# EAGLE design AeroQuadMini_v201 (EAGLE 5.11)
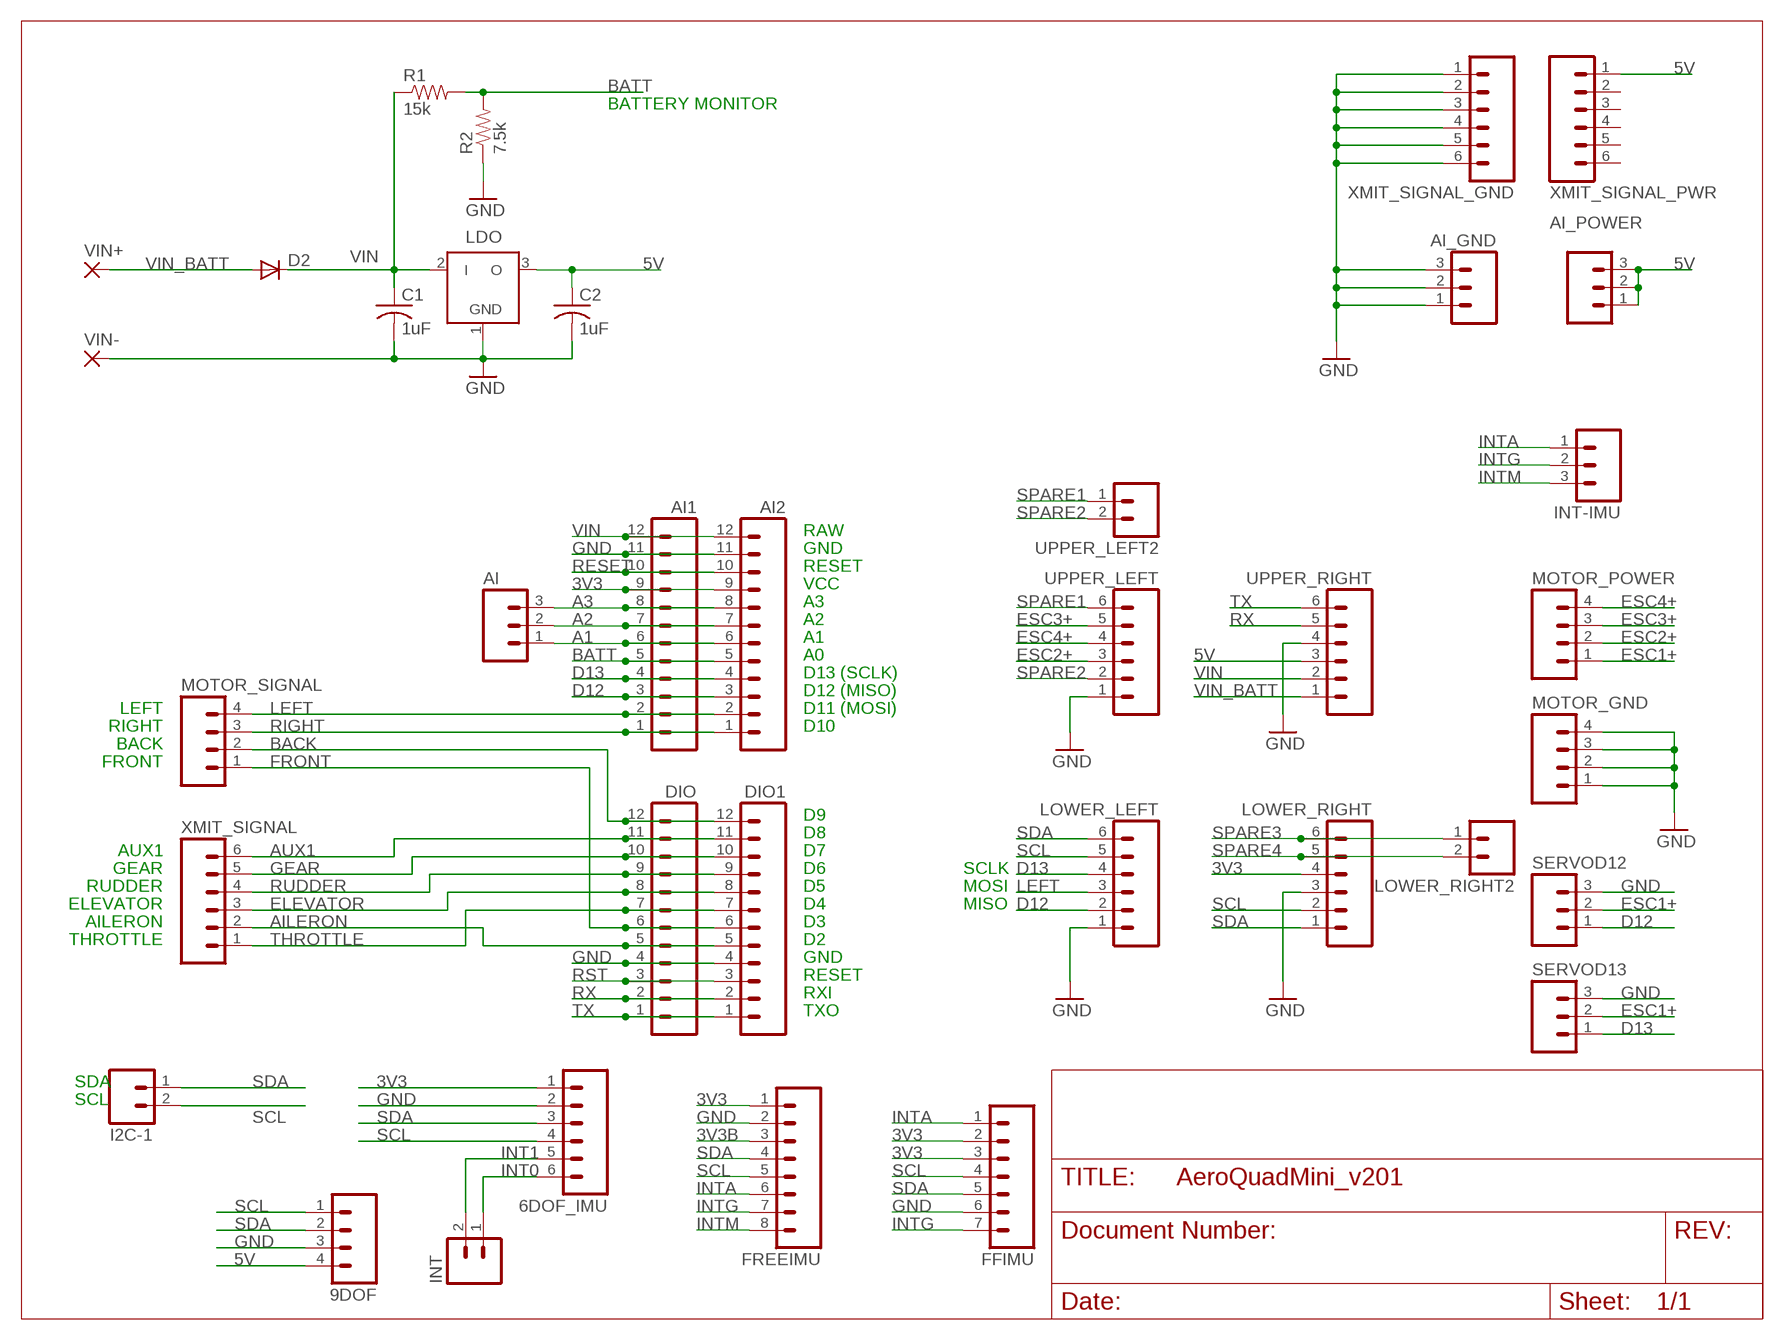
[diagram p0: schematic, sheet 1]

## Parts
6DOF_IMU  M06LOCK  [1X06_LOCK]
9DOF  M04LOCK  [1X04_LOCK]
AI  M03LOCK  [1X03_LOCK]
AI1  M12LOCK  [1X12_LOCK]
AI2  M12LOCK  [1X12_LOCK]
AI_GND  M03LOCK  [1X03_LOCK]
AI_POWER  M03LOCK  [1X03_LOCK]
C1  1uF  C-US050-024X044  [C050-024X044]
C2  1uF  C-US050-024X044  [C050-024X044]
D2  DIODEPTH  [DIODE-1N4001]
DIO  M12LOCK  [1X12_LOCK]
DIO1  M12LOCK  [1X12_LOCK]
FFIMU  M07LOCK  [1X07_LOCK]
FREEIMU  M08LOCK  [1X08_LOCK]
I2C-1  M02LOCK  [1X02_LOCK]
INT  M02PTH  [1X02]
INT-IMU  M03LOCK  [1X03_LOCK]
LDO  MCP1702-33  MCP1702Z  [TO92]
LOWER_LEFT  M06LOCK  [1X06_LOCK]
LOWER_RIGHT  M06LOCK  [1X06_LOCK]
LOWER_RIGHT2  M02LOCK  [1X02_LOCK]
MOTOR_GND  M04LOCK  [1X04_LOCK]
MOTOR_POWER  M04LOCK  [1X04_LOCK]
MOTOR_SIGNAL  M04LOCK  [1X04_LOCK]
R1  15k  RESISTORPTH-1/6W  [1/6W-RES]
R2  7.5k  RESISTORPTH-1/6W  [1/6W-RES]
SERVOD12  M03LOCK  [1X03_LOCK]
SERVOD13  M03LOCK  [1X03_LOCK]
UPPER_LEFT  M06LOCK  [1X06_LOCK]
UPPER_LEFT2  M02LOCK  [1X02_LOCK]
UPPER_RIGHT  M06LOCK  [1X06_LOCK]
VIN+  3,81/1,4  [3,81/1,4]
VIN-  3,81/1,4  [3,81/1,4]
XMIT_SIGNAL  M06LOCK  [1X06_LOCK]
XMIT_SIGNAL_GND  M06LOCK  [1X06_LOCK]
XMIT_SIGNAL_PWR  M06LOCK  [1X06_LOCK]

## Nets
3V3: 6DOF_IMU.1 AI1.9 AI2.9 FFIMU.2 FFIMU.3 FREEIMU.1 LOWER_RIGHT.4
3V3B: FREEIMU.3
5V: 9DOF.4 AI_POWER.1 AI_POWER.2 AI_POWER.3 C2.1 LDO.3(O) UPPER_RIGHT.3 XMIT_SIGNAL_PWR.1
A1: AI1.6 AI2.6 AI.1
A2: AI1.7 AI2.7 AI.2
A3: AI1.8 AI2.8 AI.3
AILERON: DIO1.5 DIO.5 XMIT_SIGNAL.2
AUX1: DIO1.11 DIO.11 XMIT_SIGNAL.6
BACK: DIO1.12 DIO.12 MOTOR_SIGNAL.2
BATT: AI1.5 AI2.5 R1.2 R2.2
D12: AI1.3 AI2.3 LOWER_LEFT.2 SERVOD12.1
D13: AI1.4 AI2.4 LOWER_LEFT.4 SERVOD13.1
ELEVATOR: DIO1.8 DIO.8 XMIT_SIGNAL.3
ESC1+: MOTOR_POWER.1 SERVOD12.2 SERVOD13.2
ESC2+: MOTOR_POWER.2 UPPER_LEFT.3
ESC3+: MOTOR_POWER.3 UPPER_LEFT.5
ESC4+: MOTOR_POWER.4 UPPER_LEFT.4
FRONT: DIO1.6 DIO.6 MOTOR_SIGNAL.1
GEAR: DIO1.10 DIO.10 XMIT_SIGNAL.5
GND: 6DOF_IMU.2 9DOF.3 AI1.11 AI2.11 AI_GND.1 AI_GND.2 AI_GND.3 C1.2 C2.2 DIO1.4 DIO.4 FFIMU.6 FREEIMU.2 LDO.1(GND) LOWER_LEFT.1 LOWER_RIGHT.3 MOTOR_GND.1 MOTOR_GND.2 MOTOR_GND.3 MOTOR_GND.4 R2.1 SERVOD12.3 SERVOD13.3 UPPER_LEFT.1 UPPER_RIGHT.4 VIN-.1(P) XMIT_SIGNAL_GND.1 XMIT_SIGNAL_GND.2 XMIT_SIGNAL_GND.3 XMIT_SIGNAL_GND.4 XMIT_SIGNAL_GND.5 XMIT_SIGNAL_GND.6
INT0: 6DOF_IMU.6 INT.1
INT1: 6DOF_IMU.5 INT.2
INTA: FFIMU.1 FREEIMU.6 INT-IMU.1
INTG: FFIMU.7 FREEIMU.7 INT-IMU.2
INTM: FREEIMU.8 INT-IMU.3
LEFT: AI1.2 AI2.2 LOWER_LEFT.3 MOTOR_SIGNAL.4
RESET: AI1.10 AI2.10
RIGHT: AI1.1 AI2.1 MOTOR_SIGNAL.3
RST: DIO1.3 DIO.3
RUDDER: DIO1.9 DIO.9 XMIT_SIGNAL.4
RX: DIO1.2 DIO.2 UPPER_RIGHT.5
SCL: 6DOF_IMU.4 9DOF.1 FFIMU.4 FREEIMU.5 I2C-1.2 LOWER_LEFT.5 LOWER_RIGHT.2
SDA: 6DOF_IMU.3 9DOF.2 FFIMU.5 FREEIMU.4 I2C-1.1 LOWER_LEFT.6 LOWER_RIGHT.1
SPARE1: UPPER_LEFT2.1 UPPER_LEFT.6
SPARE2: UPPER_LEFT2.2 UPPER_LEFT.2
SPARE3: LOWER_RIGHT2.1 LOWER_RIGHT.6
SPARE4: LOWER_RIGHT2.2 LOWER_RIGHT.5
THROTTLE: DIO1.7 DIO.7 XMIT_SIGNAL.1
TX: DIO1.1 DIO.1 UPPER_RIGHT.6
VIN: AI1.12 AI2.12 C1.1 D2.C LDO.2(I) R1.1 UPPER_RIGHT.2
VIN_BATT: D2.A UPPER_RIGHT.1 VIN+.1(P)
Unconnected: XMIT_SIGNAL_PWR.2 XMIT_SIGNAL_PWR.3 XMIT_SIGNAL_PWR.4 XMIT_SIGNAL_PWR.5 XMIT_SIGNAL_PWR.6

## Notes on the sheet
- BATTERY MONITOR
- RAW
- GND
- RESET
- VCC
- A3
- A2
- A1
- A0
- D13 (SCLK)
- D12 (MISO)
- LEFT | D11 (MOSI)
- RIGHT | D10
- BACK
- FRONT
- D9
- D8
- AUX1 | D7
- GEAR | D6 | SCLK
- RUDDER | D5 | MOSI
- ELEVATOR | D4 | MISO
- AILERON | D3
- THROTTLE | D2
- GND
- RESET
- RXI
- TXO
- SDA
- SCL

## Library data of the parts
6DOF_IMU LOWER_LEFT LOWER_RIGHT UPPER_LEFT UPPER_RIGHT XMIT_SIGNAL XMIT_SIGNAL_GND XMIT_SIGNAL_PWR = SparkFun:M06: Header 6 Standard 6-pin 0.1" header. Use with straight break away headers (SKU : PRT-00116), right angle break away headers (PRT-00553), swiss pins (PRT-00743), machine pins (PRT-00117), and female headers (PRT-00115). Molex polarized connector foot print use with SKU : PRT-08094 with associated crimp pins and housings. NOTES ON THE VARIANTS LOCK and LOCK_LONGPADS... This footprint was designed to help hold the alignment of a through-hole component (i.e. 6-pin header) while soldering it into place. You may notice that each hole has been shifted either up or down by 0.005 of an inch from it's more standard position (which is a perfectly straight line). This slight alteration caused the pins (the squares in the middle) to touch the edges of the holes. Because they are alternating, it causes a "brace" to hold the component in place. 0.005 has proven to be the perfect amount of "off-center" position when using our standard breakaway headers. Although looks a little odd when you look at the bare footprint, once you have a header in there, the alteration is very hard to notice. Also, if you push a header all the way into place, it is covered up entirely on the bottom side. This idea of altering the position of holes to aid alignment will be further integrated into the Sparkfun Library for other footprints. It can help hold any component with 3 or more connection pins.
9DOF MOTOR_GND MOTOR_POWER MOTOR_SIGNAL = SparkFun:M04: Header 4 Standard 4-pin 0.1" header. Use with straight break away headers (SKU : PRT-00116), right angle break away headers (PRT-00553), swiss pins (PRT-00743), machine pins (PRT-00117), and female headers (PRT-00115). Molex polarized connector foot print use with SKU : PRT-08231 with associated crimp pins and housings. 1MM SMD Version SKU: PRT-10208
AI AI_GND AI_POWER INT-IMU SERVOD12 SERVOD13 = SparkFun:M03: Header 3 Standard 3-pin 0.1" header. Use with straight break away headers (SKU : PRT-00116), right angle break away headers (PRT-00553), swiss pins (PRT-00743), machine pins (PRT-00117), and female headers (PRT-00115). Molex polarized connector foot print use with SKU : PRT-08232 with associated crimp pins and housings.
AI1 AI2 DIO DIO1 = SparkFun:M12: Header 12 Standard 12-pin 0.1" header. Use with straight break away headers (SKU : PRT-00116), right angle break away headers (PRT-00553), swiss pins (PRT-00743), machine pins (PRT-00117), and female headers (PRT-00115).
C1 C2 = resistor:C-US: CAPACITOR, American symbol
D2 = SparkFun:DIODE: Diode These are standard reverse protection diodes and small signal diodes. SMA package can handle up to about 1A. SOD-323 can handle about 200mA. What the SOD-323 package when ordering, there are some mfgs out there that are 5-pin packages.
FFIMU = SparkFun:M07: Header 7 Standard 7-pin 0.1" header. Use with straight break away headers (SKU : PRT-00116), right angle break away headers (PRT-00553), swiss pins (PRT-00743), machine pins (PRT-00117), and female headers (PRT-00115). NOTES ON THE VARIANTS LOCK and LOCK_LONGPADS... This footprint was designed to help hold the alignment of a through-hole component (i.e. 7-pin header) while soldering it into place. You may notice that each hole has been shifted either up or down by 0.005 of an inch from it's more standard position (which is usually a perfectly straight line). This slight alteration caused the pins (the squares in the middle) to touch the edges of the holes. Because they are alternating, it causes a "brace" to hold the header in place. 0.005 has proven to be the perfect amount of "off-center" position when using our standard breakaway headers. Although looks a little odd when you look at the bare footprint, once you have a header in there, the alteration is very hard to notice. Also, if you push a header all the way into place, it is covered up entirely on the bottom side. This idea of altering the position of holes to aid alignment will be further integrated into the Sparkfun Library for other footprints. It can help hold any component with 3 or more connection pins.
FREEIMU = SparkFun:M08: Header 8 Standard 8-pin 0.1" header. Use with straight break away headers (SKU : PRT-00116), right angle break away headers (PRT-00553), swiss pins (PRT-00743), machine pins (PRT-00117), and female headers (PRT-00115).
I2C-1 INT LOWER_RIGHT2 UPPER_LEFT2 = SparkFun:M02: Header 2 Standard 2-pin 0.1" header. Use with straight break away headers (SKU : PRT-00116), right angle break away headers (PRT-00553), swiss pins (PRT-00743), machine pins (PRT-00117), and female headers (PRT-00115). Molex polarized connector foot print use with SKU : PRT-08233 with associated crimp pins and housings.
LDO = JeeLabs:MCP1702: 200 mA, Low Power Low Dropout Voltage Regulator
R1 R2 = SparkFun:RESISTOR: Resistor Basic schematic elements and footprints for 0603, 1206, and PTH 1/10th watt (small) resistors.
VIN+ VIN- = wirepad:3,81/1,4: THROUGH-HOLE PAD

## Net classes
1 power: width 0.381 mm, clearance 0.254 mm

## Board
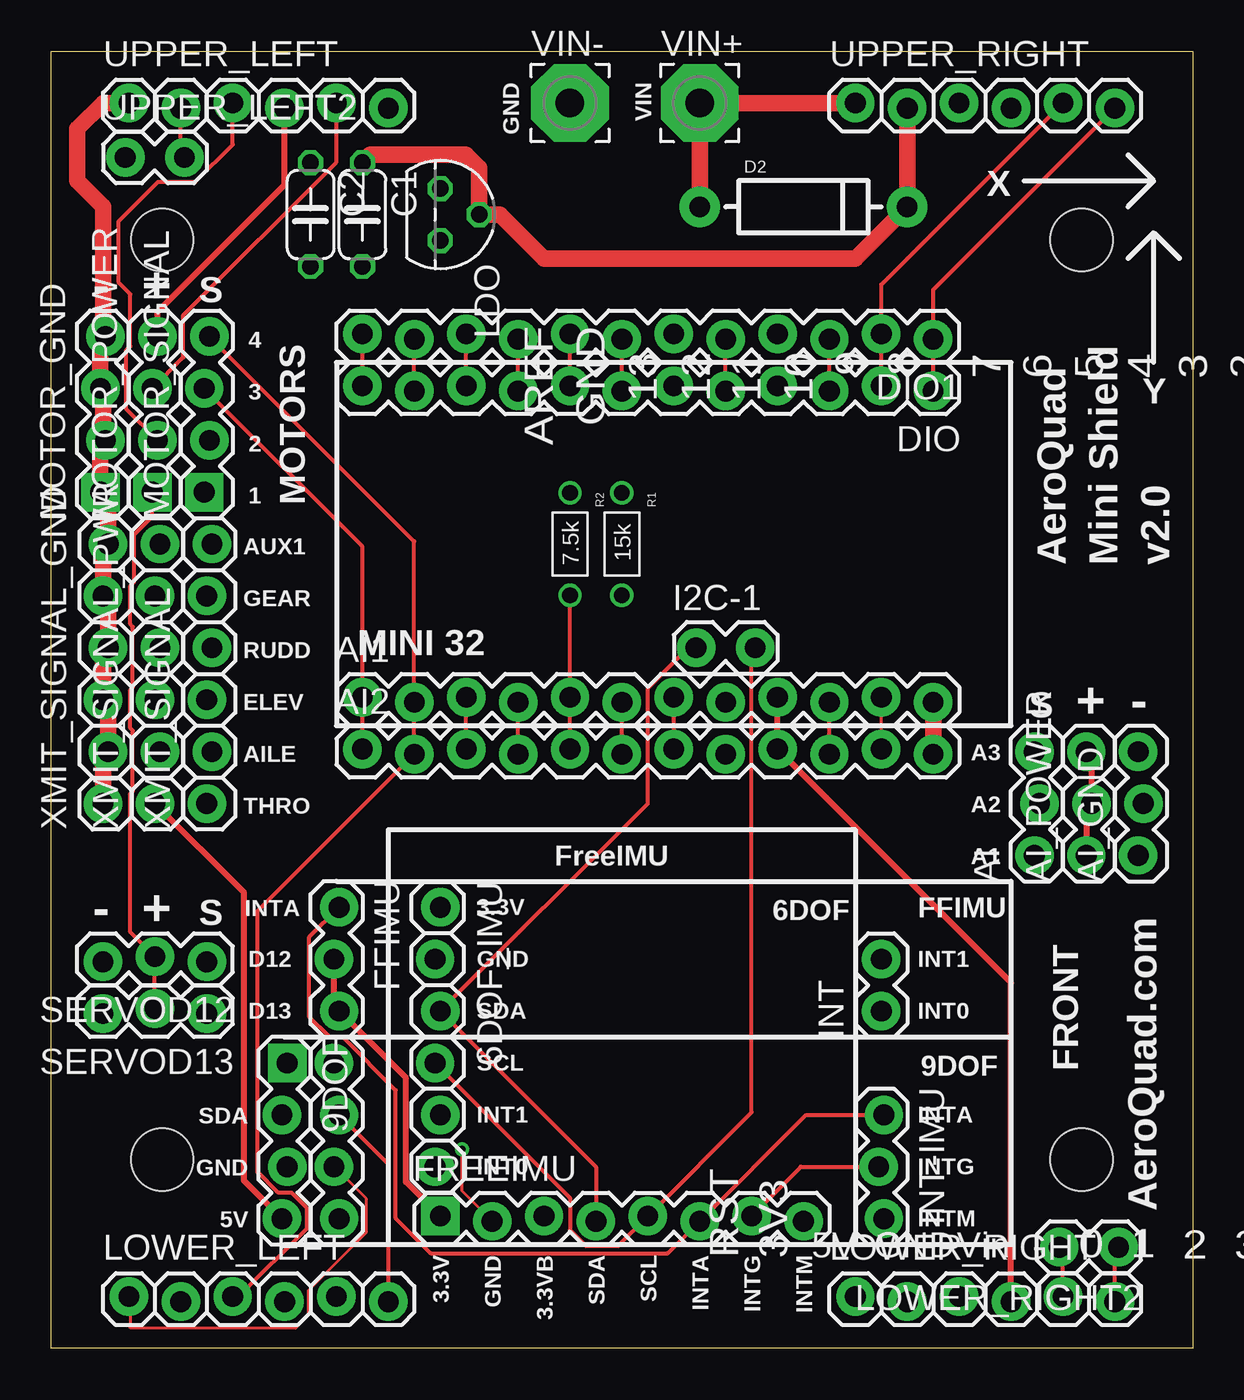
[diagram p1: board, top side]
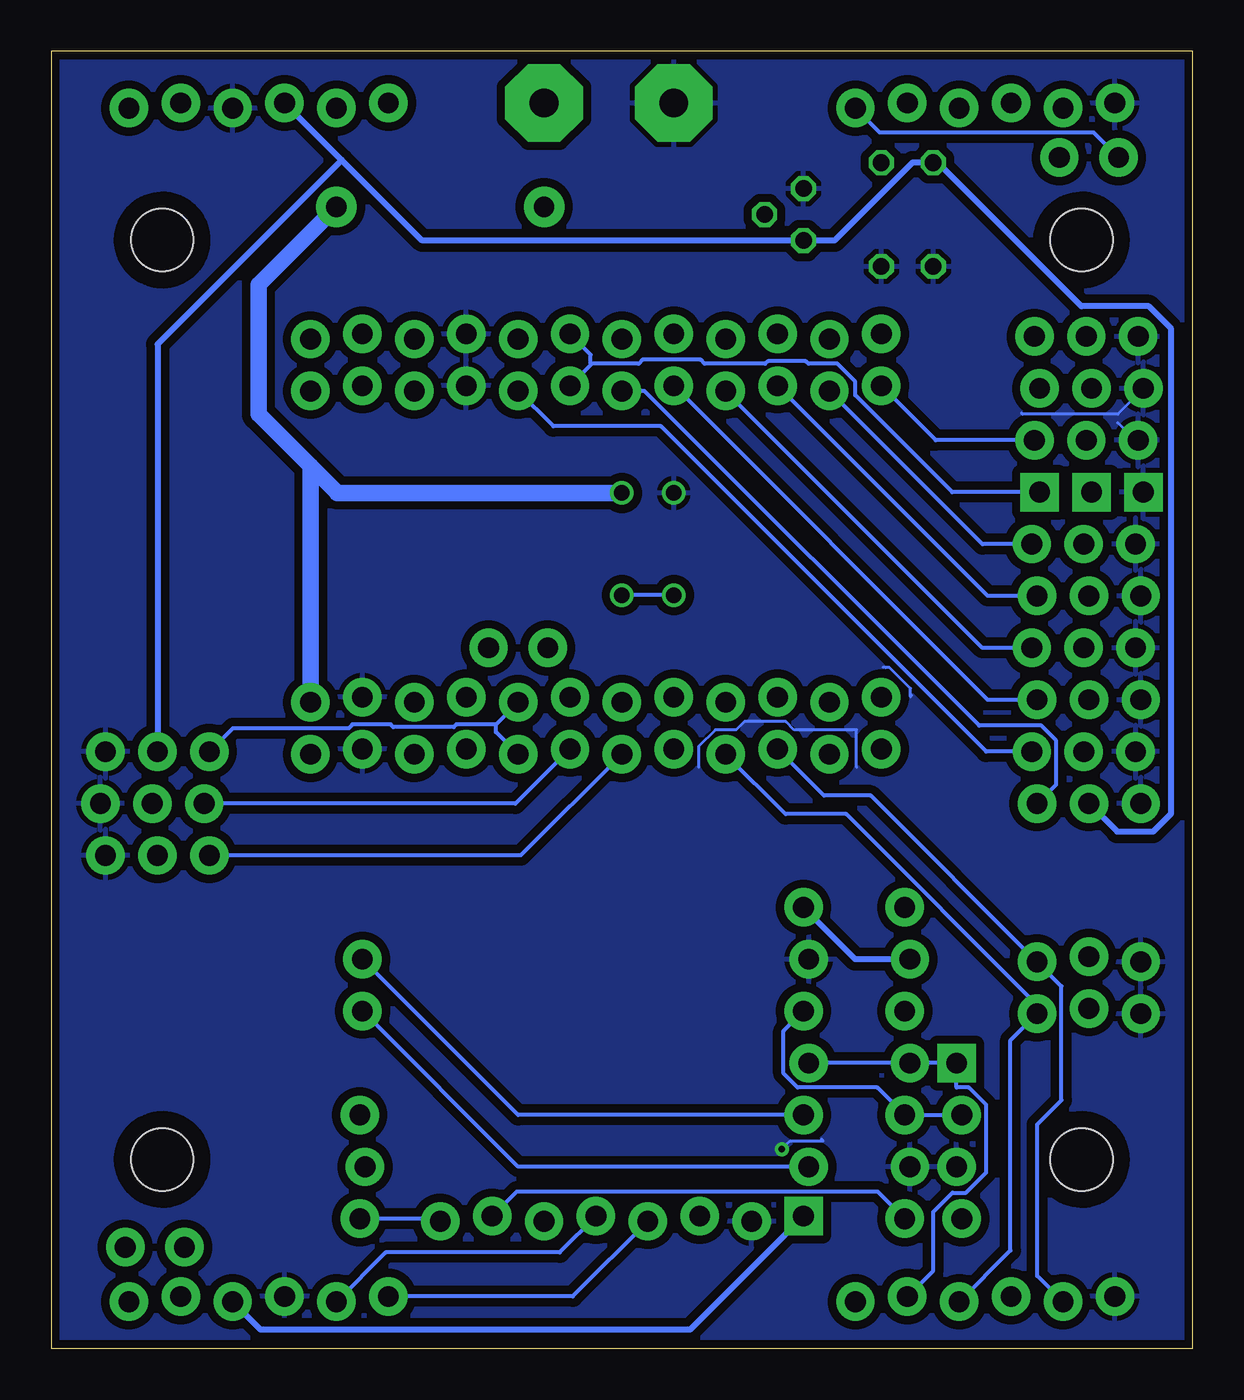
[diagram p2: board, bottom side, seen from below]

Size 55.88 x 63.5 mm. Coordinates in mm from the lower left corner, seen from the top.
Outline: 0,63.5 55.88,63.5 55.88,0 0,0 0,63.5
Copper layers (1*16): Top 0.0356mm / dielectric 1.5011mm / Bottom 0.0356mm
Design rules "LaenPCBOrder": minimum track width 6mil, minimum drill 13mil, track to track 6mil, track to pad 6mil, pad to pad 6mil, via to via 6mil, smd to smd 6mil, copper to edge 15mil, drill to drill 6mil, minimum pad ring 7mil, minimum via ring 7mil, stop-mask expansion 4mil, vias tented up to drill 0mil, thermal gap 10mil

### Footprints (pad centres in the part's own frame; a part is rotated, then mirrored left to right if it is on the bottom)
1X06_LOCK = drill 1.016 pad 1.88 round: 1 0,0; 2 2.54,-0.254; 3 5.08,0; 4 7.62,-0.254; 5 10.16,0; 6 12.7,-0.254
1X04_LOCK = drill 1.016 pad 1.88 square: 1 0,0.127 | drill 1.016 pad 1.88 round: 2 2.54,-0.127; 3 5.08,0.127; 4 7.62,-0.127
1X03_LOCK = drill 1.016 pad 1.88 round: 1 0,0.127; 2 2.54,-0.127; 3 5.08,0.127
1X12_LOCK = drill 1.016 pad 1.88 round: 1 0,0.127; 2 2.54,-0.127; 3 5.08,0.127; 4 7.62,-0.127; 5 10.16,0.127; 6 12.7,-0.127; 7 15.24,0.127; 8 17.78,-0.127; 9 20.32,0.127; 10 22.86,-0.127; 11 25.4,0.127; 12 27.94,-0.127
C050-024X044 = drill 0.813 octagon: 1 -2.54,0; 2 2.54,0
DIODE-1N4001 = drill 1 pad 1.981 round: A -5.08,0; C 5.08,0
1X07_LOCK = drill 1.016 pad 1.88 round: 1 0,0.127; 2 2.54,-0.127; 3 5.08,0.127; 4 7.62,-0.127; 5 10.16,0.127; 6 12.7,-0.127; 7 15.24,0.127
1X08_LOCK = drill 1.016 pad 1.88 square: 1 0,0.127 | drill 1.016 pad 1.88 round: 2 2.54,-0.127; 3 5.08,0.127; 4 7.62,-0.127; 5 10.16,0.127; 6 12.7,-0.127; 7 15.24,0.127; 8 17.78,-0.127
1X02_LOCK = drill 1.016 pad 1.88 round: 1 -0.178,0; 2 2.718,0
1X02 = drill 1.016 pad 1.88 round: 1 0,0; 2 2.54,0
TO92 = drill 0.813 octagon: 1 -1.27,0; 2 0,1.905; 3 1.27,0
1/6W-RES = drill 0.762 round: 1 -2.5,0; 2 2.5,0
STAND-OFF-TIGHT = hole 3.048: 0,0
3,81/1,4 = drill 1.397 pad 3.81 octagon: 1 0,0

### Placement (x,y rotation side)
6DOF_IMU  19.05,21.59 270 top
9DOF  11.43,13.97 270 top
AI  48.26,24.13 90 top
AI1  15.24,31.75 0 top
AI2  15.24,29.21 0 top
AI_GND  53.34,24.13 90 top
AI_POWER  50.8,24.13 90 top
C1  15.24,55.5 270 top
C2  12.7,55.5 270 top
D2  36.83,55.88 0 top
DIO  43.18,46.99 180 top
DIO1  43.18,49.53 180 top
FFIMU  13.97,21.59 270 top
FREEIMU  19.05,6.35 0 top
I2C-1  31.75,34.29 0 top
INT  40.64,16.51 90 top
INT-IMU  40.64,11.43 270 top
LDO  19.05,55.5 270 top
LOWER_LEFT  3.81,2.54 0 top
LOWER_RIGHT  39.37,2.54 0 top
LOWER_RIGHT2  52.07,4.95 180 top
MOTOR_GND  2.54,41.91 90 top
MOTOR_POWER  5.08,41.91 90 top
MOTOR_SIGNAL  7.62,41.91 90 top
R1  27.94,39.37 270 top
R2  25.4,39.37 270 top
SERVOD12  7.62,19.05 180 top
SERVOD13  7.62,16.51 180 top
U$1  [STAND-OFF-TIGHT]  5.44,9.25 0 top
U$2  [STAND-OFF-TIGHT]  50.44,9.25 0 top
U$3  [STAND-OFF-TIGHT]  50.44,54.25 0 top
U$5  [STAND-OFF-TIGHT]  5.44,54.25 0 top
UPPER_LEFT  3.81,60.96 0 top
UPPER_LEFT2  3.81,58.29 0 top
UPPER_RIGHT  39.37,60.96 0 top
VIN+  31.75,60.96 0 top
VIN-  25.4,60.96 0 top
XMIT_SIGNAL  7.62,26.67 90 top
XMIT_SIGNAL_GND  2.54,26.67 90 top
XMIT_SIGNAL_PWR  5.08,26.67 90 top

### Tracks (layer width: path | path; a pad name or v marks a point on that pad's centre or on a via)
3V3
  Top 0.305: FREEIMU.1 17.37,8.15 17.37,13.23 FFIMU.3 13.84,16.76 FFIMU.2 | LOWER_RIGHT.4 46.99,17.91 AI2.9 AI1.9
  Bottom 0.305: FFIMU.2 16.51,19.05 6DOF_IMU.1 | LOWER_RIGHT.4 45.63,0.92 24.61,0.92 FREEIMU.1
5V
  Top 0.305: XMIT_SIGNAL_PWR.1 9.44,22.31 9.44,8.21 9DOF.4 | AI_POWER.1 50.67,26.42 AI_POWER.2 50.93,28.96 AI_POWER.3
  Bottom 0.305: 41.66,58.16 UPPER_RIGHT.3 | 41.66,58.16 37.72,54.23 LDO.3 17.53,54.23 13.72,58.04 C2.1 12.48,58.04 11.68,57.25 5.44,51 2.15,51 1.05,49.91 1.05,26.18 1.93,25.29 3.7,25.29 XMIT_SIGNAL_PWR.1 | 41.66,58.16 50.67,49.15 AI_POWER.3
A1
  Top 0.203: AI2.6 AI1.6
  Bottom 0.203: AI2.6 32.89,24.13 AI.1
A2
  Top 0.203: AI2.7 AI1.7
  Bottom 0.203: AI2.7 33.15,26.67 AI.2
A3
  Bottom 0.203: 34.1,30.54 36.04,30.54 36.17,30.42 39.13,30.42 39.26,30.54 41.12,30.54 41.31,30.35 46.99,30.35 AI.3 | 34.1,30.54 AI1.8 | AI2.8 34.1,30.16 34.1,30.54
AILERON
  Top 0.203: DIO.5 DIO1.5
  Bottom 0.203: XMIT_SIGNAL.2 10.11,29.21 26.04,45.14 31.3,45.14 DIO.5
AUX1
  Top 0.203: DIO.11 DIO1.11
  Bottom 0.203: XMIT_SIGNAL.6 10.29,39.37 DIO.11
BACK
  Top 0.203: DIO.12 DIO1.12
  Bottom 0.203: MOTOR_SIGNAL.2 12.57,44.45 DIO.12
BATT
  Top 0.203: AI2.5 AI1.5 R2.2
  Bottom 0.203: R2.2 R1.2
D12
  Top 0.203: AI2.3 AI1.3
  Bottom 0.203: LOWER_LEFT.2 7.62,3.55 7.62,10.96 6.42,12.15 6.42,17.73 SERVOD12.1 15.76,27.06 18.04,27.06 AI2.3
D13
  Top 0.203: AI2.4 AI1.4
  Bottom 0.203: LOWER_LEFT.4 8.91,4.8 8.91,15.09 SERVOD13.1 7.62,16.81 16.96,26.16 19.93,26.16 AI2.4
ELEVATOR
  Top 0.203: DIO.8 DIO1.8
  Bottom 0.203: XMIT_SIGNAL.3 10.03,31.75 DIO.8
ESC1+
  Top 0.203: MOTOR_POWER.1 4.95,40.72 4.06,39.83 4.06,37.5 3.87,37.31 3.87,35.45 4,35.32 4,32.36 3.87,32.23 3.87,30.37 4,30.24 4,27.28 3.87,27.15 3.87,20.38 SERVOD12.2 SERVOD13.2
ESC2+
  Top 0.203: UPPER_LEFT.3 8.89,58.93 7.06,57.1 5.24,57.1 3.31,55.18 3.31,52.16 3.87,51.6 3.87,49.05 3.68,48.86 3.68,45.97 MOTOR_POWER.2
ESC3+
  Top 0.203: UPPER_LEFT.5 13.97,58.06 6.48,50.57 6.48,48.51 MOTOR_POWER.3
ESC4+
  Top 0.305: UPPER_LEFT.4 11.43,56.97 5.21,50.75 MOTOR_POWER.4
FRONT
  Bottom 0.203: 29.46,48.2 29.46,48.64 DIO1.6 | DIO.6 29.46,48.13 29.46,48.2 | MOTOR_SIGNAL.1 11.77,41.91 16.51,46.65 16.51,47.32 17.39,48.2 18.81,48.2 18.94,48.32 20.8,48.32 20.93,48.2 23.89,48.2 24.08,48.39 26.92,48.39 27.11,48.2 29.46,48.2
GEAR
  Top 0.203: DIO.10 DIO1.10
  Bottom 0.203: XMIT_SIGNAL.5 10.03,36.83 DIO.10
GND  (via drill 0.33)
  Top 0.152: v20.12,9.75 20.12,7.72 21.54,6.3 FREEIMU.2 | FFIMU.6 14.02,8.74 15.44,7.32 15.44,5.69 12.6,2.85 12.6,1.63 11.99,1.02 3.86,1.02 3.86,2.44 LOWER_LEFT.1 | AI2.11 40.64,29.46 40.64,31.7 AI1.11 | 2.64,44.3 MOTOR_GND.2 2.64,44.3
  Top 0.813: UPPER_LEFT.1 2.54,60.96 1.27,59.69 1.27,57.15 2.54,55.88 2.54,49.66 MOTOR_GND.4 2.41,49.28 MOTOR_GND.3 | 2.54,46.99 2.54,44.4 2.64,44.3 2.41,44.07 MOTOR_GND.1 2.79,41.53 XMIT_SIGNAL_GND.6 2.54,39.12 XMIT_SIGNAL_GND.5 2.79,36.58 XMIT_SIGNAL_GND.4 2.54,34.04 XMIT_SIGNAL_GND.3 2.79,31.5 XMIT_SIGNAL_GND.2 2.54,28.96 XMIT_SIGNAL_GND.1
  Bottom 0.152: v20.12,9.75 19.71,10.16 18.09,10.16 18.16,10.24 | 13.76,31.96 13.82,31.9 13.82,32.31 14.83,33.33 15.04,33.33 15.14,33.35 | MOTOR_GND.3 2.44,46.94 3.66,45.72 8.33,45.72 8.37,45.79 | 16.44,28.46 16.46,28.45 16.46,30.28 19.51,30.28 19.91,30.68 21.95,30.68 22.35,30.28 23.37,30.28 24.18,29.46 24.18,28.45 24.19,28.44 | MOTOR_GND.2 2.85,44.5 3.66,45.31 3.67,45.31
  pour Bottom (isolate 0.406): 0,63.5 55.88,63.5 55.88,0 0,0
INT0
  Bottom 0.203: INT.1 33.02,8.89 6DOF_IMU.6
INT1
  Bottom 0.203: INT.2 33.02,11.43 6DOF_IMU.5
INTA
  Top 0.203: FFIMU.1 12.64,20.13 12.64,16.23 13.63,15.24 14.26,15.24 16.87,12.64 16.87,6.36 18.56,4.66 30.19,4.66 FREEIMU.6 36.96,11.43 INT-IMU.1
INTG
  Top 0.203: INT-IMU.2 36.7,8.89 FREEIMU.7
  Bottom 0.203: FREEIMU.7 33.1,7.67 15.42,7.67 FFIMU.7
INTM
  Bottom 0.203: INT-IMU.3 36.96,6.35 FREEIMU.8
LEFT
  Top 0.203: LOWER_LEFT.3 9.19,2.54 12.53,5.89 12.53,6.86 11.77,7.62 11.12,7.62 10.11,8.63 10.11,21.41 AI2.2 AI1.2 17.78,39.5 MOTOR_SIGNAL.4
RESET
  Top 0.203: AI2.10 AI1.10
RIGHT
  Top 0.203: MOTOR_SIGNAL.3 15.24,39.24 AI1.1 AI2.1
RST
  Top 0.203: DIO.3 DIO1.3
RUDDER
  Top 0.203: DIO.9 DIO1.9
  Bottom 0.203: XMIT_SIGNAL.4 10.29,34.29 DIO.9
RX
  Top 0.203: DIO.2 DIO1.2 40.64,52.07 UPPER_RIGHT.5
SCL
  Top 0.203: 6DOF_IMU.4 25.4,7.37 25.4,5.8 26.18,5.02 27.75,5.02 FREEIMU.5 34.29,11.56 34.29,34.11 I2C-1.2
  Bottom 0.203: LOWER_LEFT.5 12.7,3.81 12.7,6.68 11.76,7.62 11.1,7.62 10.11,8.61 10.11,11.93 10.96,12.78 11.56,12.78 9DOF.1 FFIMU.4 6DOF_IMU.4 | LOWER_RIGHT.2 39.49,4.7 30.98,4.7 FREEIMU.5
SDA
  Top 0.203: FFIMU.5 16.51,9.02 LOWER_LEFT.6 | FREEIMU.4 26.67,8.89 6DOF_IMU.3 29.21,26.67 29.21,32.33 31.17,34.29 I2C-1.1
  Bottom 0.203: 6DOF_IMU.3 20.02,15.54 20.02,13.45 19.35,12.78 15.44,12.78 FFIMU.5 9DOF.2 | LOWER_RIGHT.1 30.35,2.54 FREEIMU.4
SPARE1
  Bottom 0.203: UPPER_LEFT2.1 4.85,59.51 15.32,59.51 UPPER_LEFT.6
SPARE2
  Top 0.203: UPPER_LEFT2.2 6.35,58.47 UPPER_LEFT.2
SPARE3
  Top 0.203: LOWER_RIGHT2.1 52.07,4.78 LOWER_RIGHT.6
SPARE4
  Top 0.203: LOWER_RIGHT2.2 49.53,4.78 LOWER_RIGHT.5
THROTTLE
  Top 0.203: DIO.7 DIO1.7
  Bottom 0.203: XMIT_SIGNAL.1 6.68,27.61 6.68,29.75 7.41,30.48 10.45,30.48 26.84,46.86 DIO.7
TX
  Top 0.203: DIO.1 DIO1.1 43.18,51.82 UPPER_RIGHT.6
VIN
  Top 0.813: UPPER_RIGHT.2 D2.C 39.37,53.34 24.13,53.34 21.97,55.5 LDO.2 20.95,57.78 20.32,58.42 15.62,58.42 C1.1 | AI1.12 AI2.12
  Bottom 0.813: D2.C 45.72,52.07 45.72,45.72 43.18,43.18 | 43.18,43.18 41.91,41.91 41.87,41.87 R1.1 | 43.18,43.18 AI1.12
VIN_BATT
  Top 0.813: D2.A VIN+.1 UPPER_RIGHT.1

### Text on the board
tPlace: GND | VIN | X | - | + | S | 4 | MOTORS | 3 | Y | 2 | 1 | AUX1 | AeroQuad | Mini Shield | v2.0 | GEAR | RUDD | MINI 32 | ELEV | S | + | - | A3 | AILE | A2 | THRO | A1 | FreeIMU | INTA | - | + | S | 3.3V | 6DOF | FFIMU | D12 | GND | INT1 | D13 | SDA | INT0 | SCL | 9DOF | FRONT | SDA | INT1 | INTA | GND | INT0 | INTG | 5V | AeroQuad.com | INTM | 3.3V | GND | 3.3VB | SDA | SCL | INTA | INTG | INTM
tNames: 9 | 8 | 7 | 6 | 5 | 4 | 3 | 2 | 1 | 0 | 13 | 12 | 11 | 10 | GND | AREF | RST | 3V3 | 5V | GND | Vin | 0 | 1 | 2 | 3 | 4 | 5